# Altium schematic sheet ROV_MAIN_SCHEMATIC02.SchDoc
size A
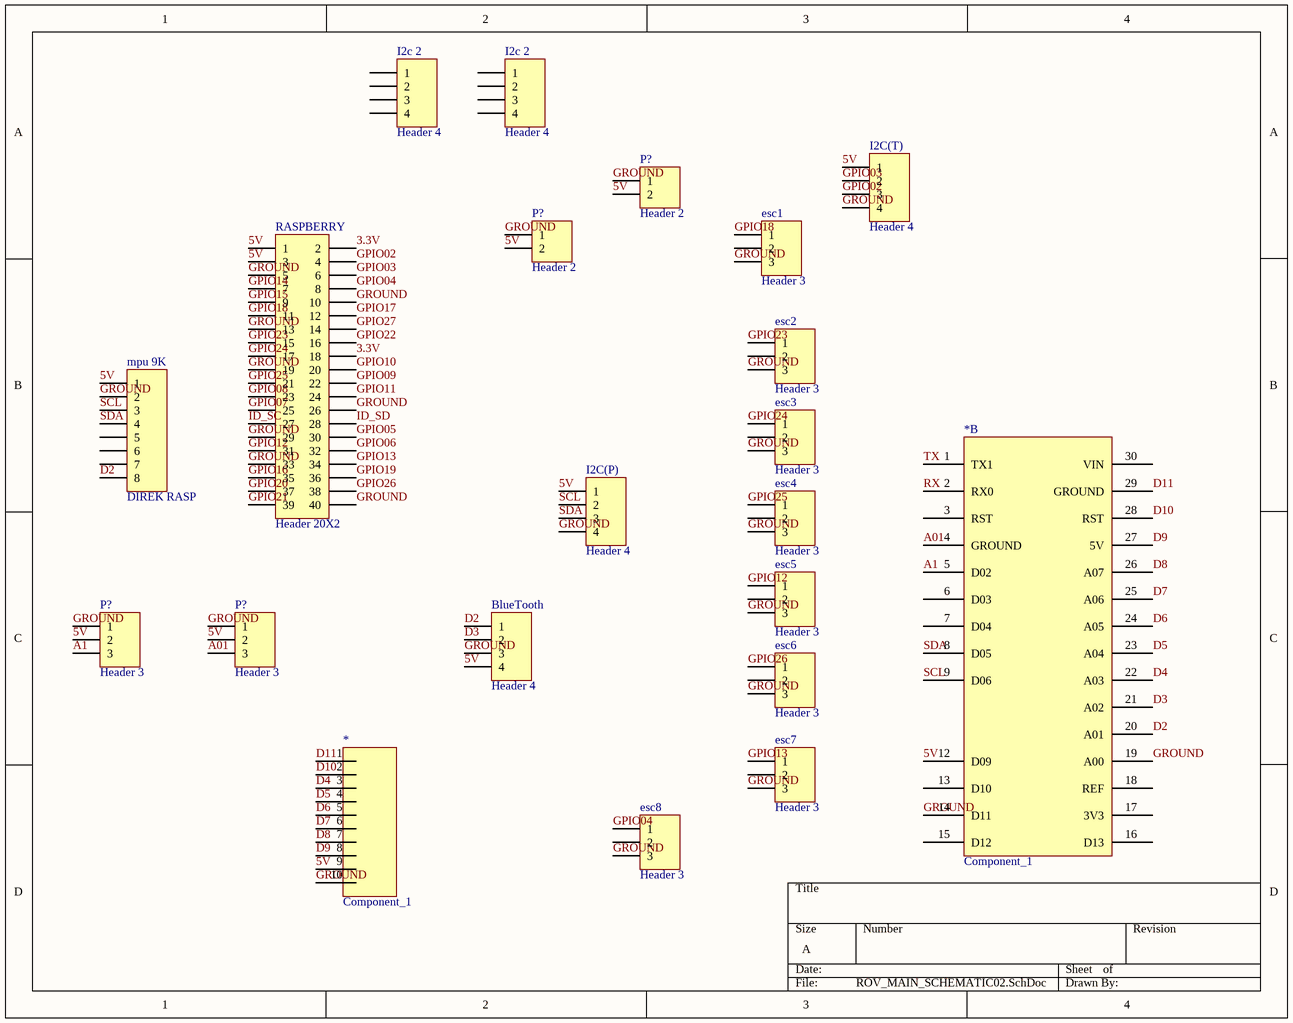
[diagram p0: ROV_MAIN_SCHEMATIC02.SchDoc]

## Parts
(Parts that share a designator on the sheet are numbered #1, #2 ... from top to bottom, then left to right.)
*#1  Component_1  [Arduino Nano]  (part A of 2)
*#2  Component_1  [Arduino Nano]  (part B of 2)
*#3  Component_1  [PCBComponent_1]
BlueTooth  Header 4  [HDR1X4]
esc1  Header 3  [HDR1X3]
esc2  Header 3  [HDR1X3]
esc3  Header 3  [HDR1X3]
esc4  Header 3  [HDR1X3]
esc5  Header 3  [HDR1X3]
esc6  Header 3  [HDR1X3]
esc7  Header 3  [HDR1X3]
esc8  Header 3  [HDR1X3]
I2C(P)  Header 4  [HDR1X4]
I2C(T)  Header 4  [HDR1X4]
I2c_2#1  Header 4  [HDR1X4]
I2c_2#2  Header 4  [HDR1X4]
mpu_9K  DIREK RASP  [HDR1X8]
P?#1  Header 2  [HDR1X2]
P?#2  Header 2  [HDR1X2]
P?#3  Header 3  [HDR1X3]
P?#4  Header 3  [HDR1X3]
RASPBERRY  Header 20X2  [HDR2X20]

## Nets
3.3V: RASPBERRY.2 RASPBERRY.18
5V: *#2.12(D09) *#3.9 BlueTooth.4 I2C(P).1 I2C(T).1 mpu_9K.1 P?#1.2 P?#2.2 P?#3.2 P?#4.2 RASPBERRY.1 RASPBERRY.3
A01: *#2.4(GROUND) P?#4.3
A1: *#2.5(D02) P?#3.3
D2: *#2.20(A01) BlueTooth.1 mpu_9K.8
D3: *#2.21(A02) BlueTooth.2
D4: *#2.22(A03) *#3.3
D5: *#2.23(A04) *#3.4
D6: *#2.24(A05) *#3.5
D7: *#2.25(A06) *#3.6
D8: *#2.26(A07) *#3.7
D9: *#2.27(5V) *#3.8
D10: *#2.28(RST) *#3.2
D11: *#2.29(GROUND) *#3.1
GPIO02: I2C(T).3 RASPBERRY.4
GPIO03: I2C(T).2 RASPBERRY.6
GPIO04: esc8.1 RASPBERRY.8
GPIO05: RASPBERRY.30
GPIO06: RASPBERRY.32
GPIO07: RASPBERRY.25
GPIO08: RASPBERRY.23
GPIO09: RASPBERRY.22
GPIO10: RASPBERRY.20
GPIO11: RASPBERRY.24
GPIO12: esc5.1 RASPBERRY.31
GPIO13: esc7.1 RASPBERRY.34
GPIO14: RASPBERRY.7
GPIO15: RASPBERRY.9
GPIO16: RASPBERRY.35
GPIO17: RASPBERRY.12
GPIO18: esc1.1 RASPBERRY.11
GPIO19: RASPBERRY.36
GPIO20: RASPBERRY.37
GPIO21: RASPBERRY.39
GPIO22: RASPBERRY.16
GPIO23: esc2.1 RASPBERRY.15
GPIO24: esc3.1 RASPBERRY.17
GPIO25: esc4.1 RASPBERRY.21
GPIO26: esc6.1 RASPBERRY.38
GPIO27: RASPBERRY.14
GROUND: *#2.14(D11) *#2.19(A00) *#3.10 BlueTooth.3 esc1.3 esc2.3 esc3.3 esc4.3 esc5.3 esc6.3 esc7.3 esc8.3 I2C(P).4 I2C(T).4 mpu_9K.2 P?#1.1 P?#2.1 P?#3.1 P?#4.1 RASPBERRY.5 RASPBERRY.10 RASPBERRY.13 RASPBERRY.19 RASPBERRY.26 RASPBERRY.29 RASPBERRY.33 RASPBERRY.40
ID_SC: RASPBERRY.27
ID_SD: RASPBERRY.28
RX: *#2.2(RX0)
SCL: *#2.9(D06) I2C(P).2 mpu_9K.3
SDA: *#2.8(D05) I2C(P).3 mpu_9K.4
TX: *#2.1(TX1)

Not connected (* = marked no-connect by the designer): *#2 3(RST) 6(D03) 7(D04) 13(D10) 15(D12) 16(D13) 17(3V3) 18(REF) 30(VIN); esc1 2; esc2 2; esc3 2; esc4 2; esc5 2; esc6 2; esc7 2; esc8 2; I2c_2#1 1 2 3 4; I2c_2#2 1 2 3 4; mpu_9K 5 6 7

## Library data of the parts
BlueTooth I2C(P) I2C(T) I2c_2#1 I2c_2#2 = Header 4: Header, 4-Pin; LatestRevisionDate: 17-Jul-2002; LatestRevisionNote: Re-released for DXP Platform.; Publisher: Altium Limited
esc1-esc8 P?#3 P?#4 = Header 3: Header, 3-Pin; LatestRevisionDate: 17-Jul-2002; LatestRevisionNote: Re-released for DXP Platform.; Publisher: Altium Limited
mpu_9K = Header 8: Header, 8-Pin; LatestRevisionDate: 17-Jul-2002; LatestRevisionNote: Re-released for DXP Platform.; Publisher: Altium Limited
P?#1 P?#2 = Header 2: Header, 2-Pin; LatestRevisionDate: 17-Jul-2002; LatestRevisionNote: Re-released for DXP Platform.; Publisher: Altium Limited
RASPBERRY = Header 20X2: Header, 20-Pin, Dual row; LatestRevisionDate: 17-Jul-2002; LatestRevisionNote: Re-released for DXP Platform.; Publisher: Altium Limited